# Altium schematic sheet Input Power.SchDoc
size A; SheetNumber: 1; SheetTotal: 4
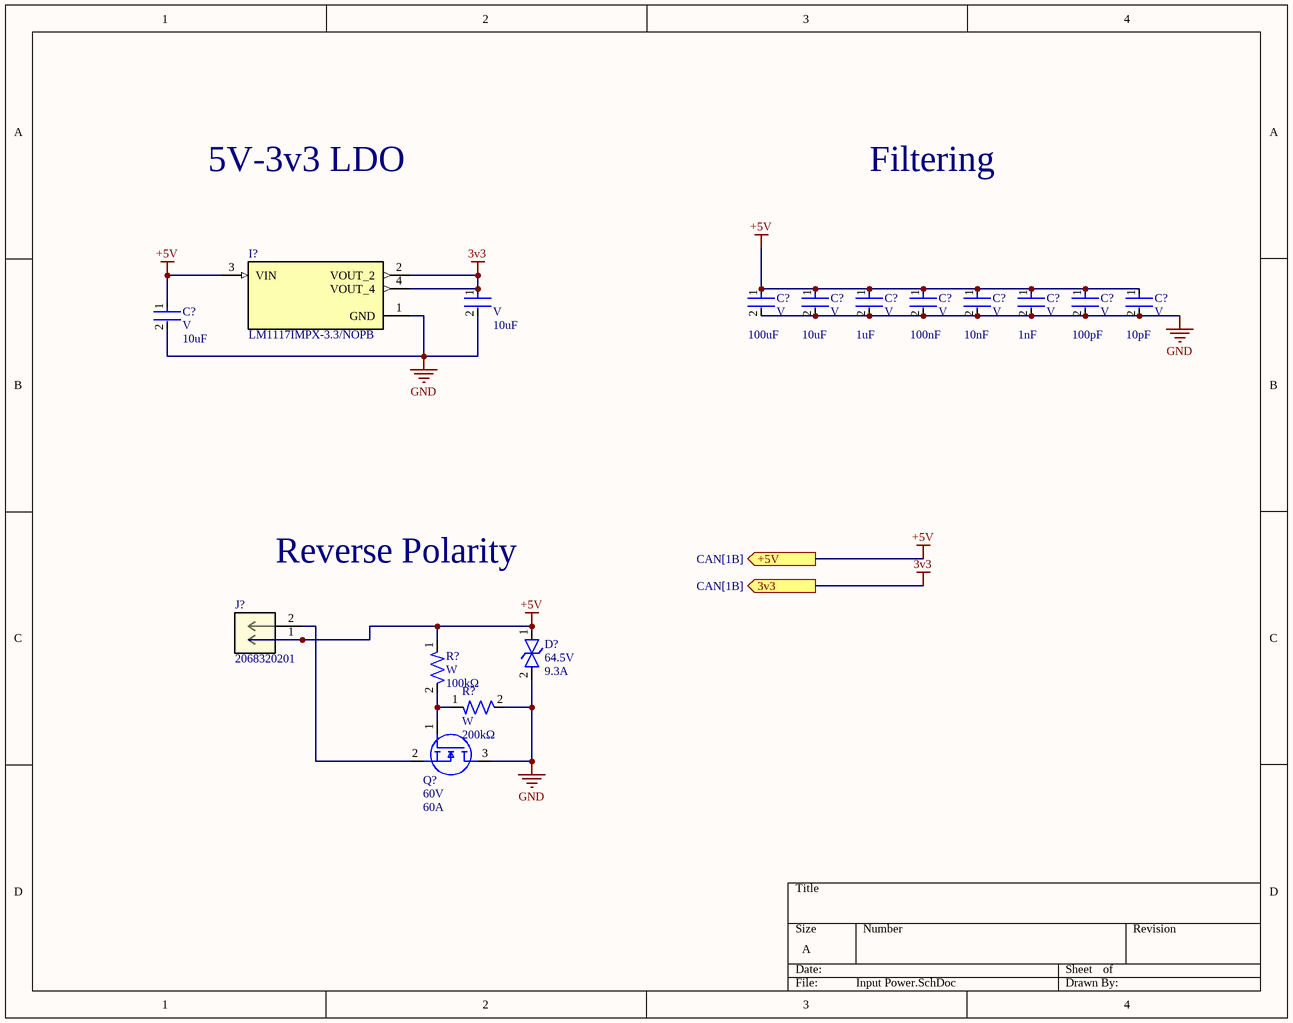
[diagram p0: Input Power.SchDoc]

## Parts
(Parts that share a designator on the sheet are numbered #1, #2 ... from top to bottom, then left to right.)
?  Voltage Rating: V  Capacitance: 10uF  [CAP-0603]  (hidden comment: CAP 0603)
C?#1  Voltage Rating: V  Capacitance: 100uF  [CAP-0603]  (hidden comment: CAP 0603)
C?#2  Voltage Rating: V  Capacitance: 10uF  [CAP-0603]  (hidden comment: CAP 0603)
C?#3  Voltage Rating: V  Capacitance: 1uF  [CAP-0603]  (hidden comment: CAP 0603)
C?#4  Voltage Rating: V  Capacitance: 100nF  [CAP-0603]  (hidden comment: CAP 0603)
C?#5  Voltage Rating: V  Capacitance: 10nF  [CAP-0603]  (hidden comment: CAP 0603)
C?#6  Voltage Rating: V  Capacitance: 1nF  [CAP-0603]  (hidden comment: CAP 0603)
C?#7  Voltage Rating: V  Capacitance: 100pF  [CAP-0603]  (hidden comment: CAP 0603)
C?#8  Voltage Rating: V  Capacitance: 10pF  [CAP-0603]  (hidden comment: CAP 0603)
C?#9  Voltage Rating: V  Capacitance: 10uF  [CAP-0603]  (hidden comment: CAP 0603)
D?  Voltage Rating: 64.5V  Current Rating: 9.3A  [DO-214AA (SMBJ)]  (hidden comment: SMBJ40CA)
I?  LM1117IMPX-3.3/NOPB  [IC-SOT-223-4]
J?  2068320201  [CONN_2068320000-SD_02_MOL]
Q?  Voltage: 60V  Continuous Current: 60A  [IC-8VSONCLIP]  (hidden comment: CSD18543Q3AT)
R?#1  Wattage: W  Resistance: 100kΩ  [RES-0603]  (hidden comment: RES 0603)
R?#2  Wattage: W  Resistance: 200kΩ  [RES-0603]  (hidden comment: RES 0603)

## Ports
3v3 (out, see CAN[1B]), +5V (out, see CAN[1B])

## Nets
3v3: ?.1 I?.2(VOUT_2) I?.4(VOUT_4) ; port 3v3
+5V: C?#1.1 C?#2.1 C?#3.1 C?#4.1 C?#5.1 C?#6.1 C?#7.1 C?#8.1 C?#9.1 D?.1 I?.3(VIN) J?.1 R?#1.1 ; port +5V
GND: ?.2 C?#1.2 C?#2.2 C?#3.2 C?#4.2 C?#5.2 C?#6.2 C?#7.2 C?#8.2 C?#9.2 D?.2 I?.1(GND) Q?.3(D) R?#2.2
NetJ?_2: J?.2 Q?.2(S)
NetQ?_1: Q?.1(G) R?#1.2 R?#2.1

## Notes on the sheet
- 5V-3v3 LDO
- Filtering
- Reverse Polarity

## Library data of the parts
? C?#9 = CAP 0603: 10u
D? = DIO-TVS-0001: TVS DIODE 40VWM 64.5VC DO214AA; ComponentLink1Description: Datasheet; ComponentLink1URL: https://www.littelfuse.com/media?resourcetype=datasheets&itemid=09a6ae9a-73cb-4ac4-acac-e6dab92ab953&filename=littelfuse_tvs_diode_smbj_datasheet.pdf
I? = IC_LDO_3V3_0001: IC REG LIN 3.3V 800MA SOT223-4; ComponentLink1Description: New link; ComponentLink1URL: https://www.ti.com/lit/ds/symlink/lm1117.pdf?HQS=dis-dk-null-digikeymode-dsf-pf-null-wwe&ts=1721700739746
J? = CONN MF+ 2 PIN VERT: Micro-Fit+ Vertical Header, Through Hole, 3.00mm Pitch, Dual Row, 2 Circuits, Tin (Sn) Plating, Glow-Wire Capable, Black, Tray; Manufacturer_Name: Molex Connector Corporation; Copyright: Copyright (C) 2025 Ultra Librarian. All rights reserved.; Manufacturer_Part_Number: 2068320201; RefDes: RefDes; Type: Type
Q? = NMOS-60A-0001: MOSFET N-CH 60V 12A/60A 8VSON; ComponentLink2Description: Datasheet; ComponentLink2URL: http://www.ti.com/lit/ds/symlink/csd18543q3a.pdf
R?#1 = RES 0603: 100